# EAGLE design CxT6 (EAGLE 4.13)
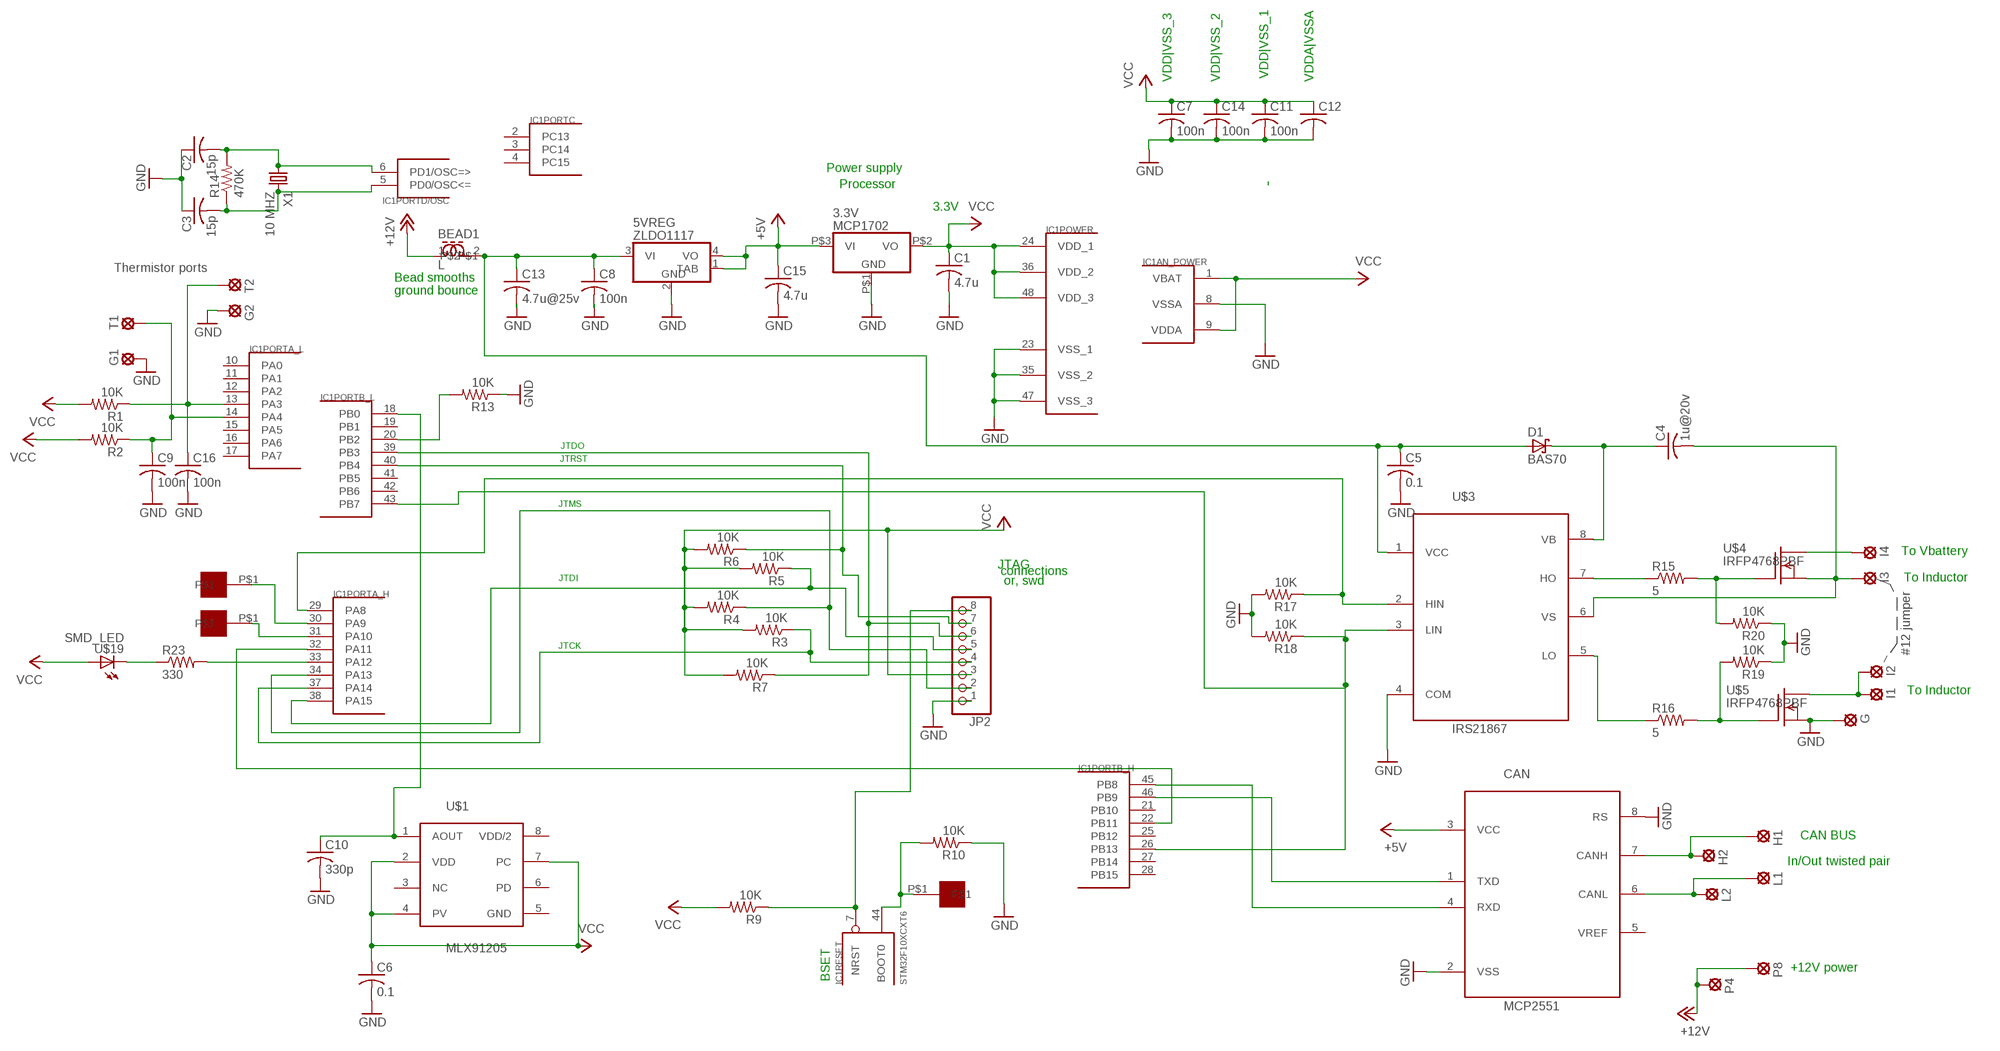
[diagram p0: schematic, sheet 1]

## Parts
3.3V  MCP1702  [SOT-23A]
5VREG  ZLDO1117  [SOT223]
B  SMD_1  [SMD_1]
BEAD1  L  L-BEAD  [C0805]
C1  4.7u  C-USC0805  [C0805]
C2  15p  C-USC0603  [C0603]
C3  15p  C-USC0603  [C0603]
C4  1u@20v  C-USC0603  [C0603]
C5  0.1  C-USC0603  [C0603]
C6  0.1  C-USC0603  [C0603]
C7  100n  C-USC0603  [C0603]
C8  100n  C-USC0603  [C0603]
C9  100n  C-USC0603  [C0603]
C10  330p  C-USC0603  [C0603]
C11  100n  C-USC0603  [C0603]
C12  C-USC0603  [C0603]
C13  4.7u@25v  C-USC0805  [C0805]
C14  100n  C-USC0603  [C0603]
C15  4.7u  C-USC0805  [C0805]
C16  100n  C-USC0603  [C0603]
CAN  MCP2551  [SO-08]
D1  BAS70  [SOT23]
G  SOLPAD081  [SOLPAD081]
G1  SOLDPAD028  [SOLPAD028]
G2  SOLDPAD028  [SOLPAD028]
H1  PE14  SOLDPAD028  [SOLPAD028]
H2  PE14  SOLDPAD028  [SOLPAD028]
I1  SOLPAD081  [SOLPAD081]
I2  SOLPAD081  [SOLPAD081]
I3  SOLPAD081  [SOLPAD081]
I4  SOLDPAD028  [SOLPAD028]
IC1  STM32F10XCXT6  [TQFP48]
JP2  PINHD-1X8  [1X08]
L1  PE14  SOLDPAD028  [SOLPAD028]
L2  PE14  SOLDPAD028  [SOLPAD028]
P4  PE14  SOLDPAD028  [SOLPAD028]
P8  PE14  SOLDPAD028  [SOLPAD028]
R  SMD_1  [SMD_1]
R1  10K  R-US_R0603  [R0603]
R2  10K  R-US_R0603  [R0603]
R3  10K  R-US_R0603  [R0603]
R4  10K  R-US_R0603  [R0603]
R5  10K  R-US_R0603  [R0603]
R6  10K  R-US_R0603  [R0603]
R7  10K  R-US_R0603  [R0603]
R9  10K  R-US_R0603  [R0603]
R10  10K  R-US_R0603  [R0603]
R13  10K  R-US_R0603  [R0603]
R14  470K  R-US_R0603  [R0603]
R15  5  R-US_R0603  [R0603]
R16  5  R-US_R0603  [R0603]
R17  10K  R-US_R0603  [R0603]
R18  10K  R-US_R0603  [R0603]
R19  10K  R-US_R0603  [R0603]
R20  10K  R-US_R0603  [R0603]
R23  330  R-US_R0603  [R0603]
T  SMD_1  [SMD_1]
T1  SOLDPAD028  [SOLPAD028]
T2  SOLDPAD028  [SOLPAD028]
U$1  MLX91205  [SO-08]
U$3  IRS21867  [SOIC8N]
U$4  IRFP4768PBF  [TO-247AC]
U$5  IRFP4768PBF  [TO-247AC]
U$19  SMD_LED  [SMD_LED]
X1  10 MHZ  CRYTALHC49UP  [HC49UP]

## Nets
+5V: 3.3V.P$3(VI) 5VREG.1(TAB) 5VREG.4(VO) C15.1 CAN.3(VCC)
+12_FILTERED: 5VREG.3(VI) BEAD1.2 C5.1 C8.1 C13.1 D1.1(A) U$3.1(VCC)
+12V: BEAD1.1 P4.MP P8.MP
BOOT0: B.P$1 IC1.44(RESET:BOOT0) R10.2
BOOT1: IC1.20(PORTB_L:PB2) R13.2
CANH: CAN.7(CANH) H1.MP H2.MP
CANL: CAN.6(CANL) L1.MP L2.MP
COM: C4.2 I3.MP U$3.6(VS) U$4.3(S)
GND: 3.3V.P$1(GND) 5VREG.2(GND) C1.2 C2.1 C3.1 C5.2 C6.2 C7.2 C8.2 C9.2 C10.2 C11.2 C12.2 C13.2 C14.2 C15.2 C16.2 CAN.2(VSS) CAN.8(RS) G1.MP G2.MP G.MP IC1.8(AN_POWER:VSSA) IC1.23(POWER:VSS_1) IC1.35(POWER:VSS_2) IC1.47(POWER:VSS_3) JP2.1 R10.1 R13.1 R17.2 R18.2 R19.1 R20.1 U$3.4(COM) U$5.3(S)
HO: R15.1 U$3.7(HO)
HO_GATE: R15.2 R20.2 U$4.1(G)
LED_K: R23.1 U$19.C
LO: R16.1 U$3.5(LO)
LO_GATE: R16.2 R19.2 U$5.1(G)
LOFET_DRAIN: I1.MP I2.MP U$5.2(D)
NRST: IC1.7(RESET:NRST) JP2.8 R9.1
OSC_IN: C3.2 IC1.5(PORTD/OSC:PD0/OSC<=) R14.1 X1.2
OSC_OUT: C2.2 IC1.6(PORTD/OSC:PD1/OSC=>) R14.2 X1.1
PA3_THERMISTOR1: C16.1 IC1.13(PORTA_L:PA3) R1.1 T2.MP
PA4_THERMISTOR2: C9.1 IC1.14(PORTA_L:PA4) R2.1 T1.MP
PA9_TX: IC1.30(PORTA_H:PA9) T.P$1
PA10_RX: IC1.31(PORTA_H:PA10) R.P$1
PA12_LED: IC1.33(PORTA_H:PA12) R23.2
PA13_JTIMS: IC1.34(PORTA_H:PA13) JP2.2 R4.1
PA14_JTCK: IC1.37(PORTA_H:PA14) JP2.4 R3.1
PA15_JTDI: IC1.38(PORTA_H:PA15) JP2.5 R5.1
PB1_ADC19_HALL: C10.1 IC1.18(PORTB_L:PB0) U$1.1(AOUT)
PB3_JTDO: IC1.39(PORTB_L:PB3) JP2.6 R7.1
PB4_JTRST: IC1.40(PORTB_L:PB4) JP2.7 R6.1
PB8_CANRX: CAN.4(RXD) IC1.45(PORTB_H:PB8)
PB9_CANTX: CAN.1(TXD) IC1.46(PORTB_H:PB9)
TIM1_1_HIN: IC1.29(PORTA_H:PA8) R17.1 U$3.2(HIN)
TIM1_1N_LIN: IC1.26(PORTB_H:PB13) IC1.43(PORTB_L:PB7) R18.1 U$3.3(LIN)
TIM14_TIM24: IC1.22(PORTB_H:PB11) IC1.32(PORTA_H:PA11)
VB: C4.1 D1.3(C) U$3.8(VB)
VBAT: I4.MP U$4.2(D)
VCC: 3.3V.P$2(VO) C1.1 C6.1 C7.1 C11.1 C12.1 C14.1 IC1.1(AN_POWER:VBAT) IC1.9(AN_POWER:VDDA) IC1.24(POWER:VDD_1) IC1.36(POWER:VDD_2) IC1.48(POWER:VDD_3) JP2.3 R1.2 R2.2 R3.2 R4.2 R5.2 R6.2 R7.2 R9.2 U$1.2(VDD) U$1.4(PV) U$1.7(PC) U$19.A
Unconnected: CAN.5(VREF) IC1.2(PORTC:PC13) IC1.3(PORTC:PC14) IC1.4(PORTC:PC15) IC1.10(PORTA_L:PA0) IC1.11(PORTA_L:PA1) IC1.12(PORTA_L:PA2) IC1.15(PORTA_L:PA5) IC1.16(PORTA_L:PA6) IC1.17(PORTA_L:PA7) IC1.19(PORTB_L:PB1) IC1.21(PORTB_H:PB10) IC1.25(PORTB_H:PB12) IC1.27(PORTB_H:PB14) IC1.28(PORTB_H:PB15) IC1.41(PORTB_L:PB5) IC1.42(PORTB_L:PB6) U$1.3(NC) U$1.6(PD) U$1.8(VDD/2)

## Notes on the sheet
- VDD|VSS_3 | VDD|VSS_2 | VDD|VSS_1 | VDDA|VSSA
- Power supply
- Processor
- 3.3V
- Thermistor ports
- Bead smooths
- ground bounce
- JTDO
- JTRST
- JTMS
- To Vbattery
- JTAG
- JTDI | connections
- or, swd | To Inductor
- JTCK
- #12 jumper
- To Inductor
- CAN BUS
- In/Out twisted pair
- +12V power
- BSET

## Power pins joined to a net without a drawn wire
GND: U$1.5(GND)

## Library data of the parts
3.3V = linear:MCP1702
5VREG = maxim:ZLDO1117
B R T = solpad:SMD_1
BEAD1 = rcl:L-BEAD
C1-C16 = rcl:C-US: CAPACITOR, American symbol
CAN = texas:MCP2551
D1 = diode-1:BAS70: Silicon Schottky Diodes General-purpose diode for high-speed switching
G I1-I3 = solpad:SOLPAD081
G1 G2 H1 H2 I4 L1 L2 P4 P8 T1 T2 = solpad:SOLDPAD028
IC1 = stm32:STM32F10XCXT6: ST STM32F101/103 48pin LQFP
JP2 = pinhead:PINHD-1X8: PIN HEADER
R1-R7 R9 R10 R13-R20 R23 = rcl:R-US_: RESISTOR, American symbol
U$1 = texas:MLX91205
U$3 = texas:IRS21867
U$4 U$5 = transistor-fet:IRFP4768PBF
U$19 = led:SMD_LED
X1 = crystal:CRYTAL: CRYSTAL

## Board
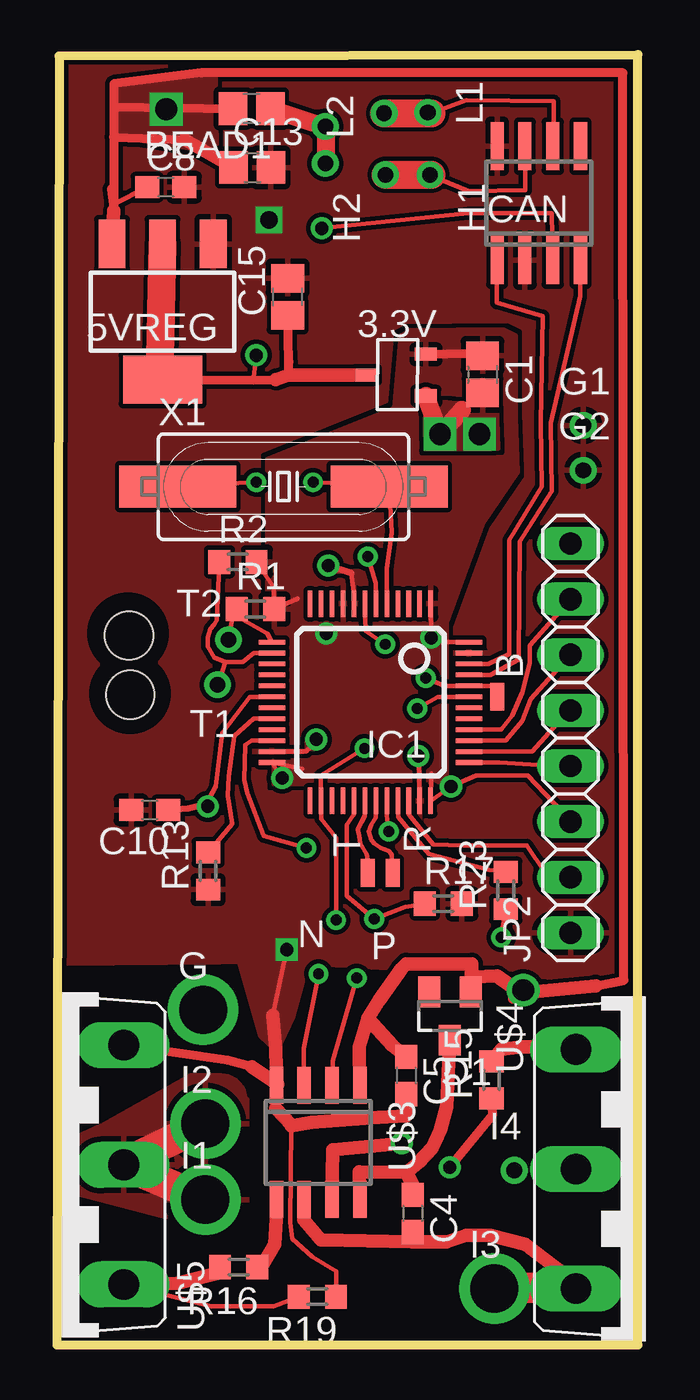
[diagram p1: board, top side]
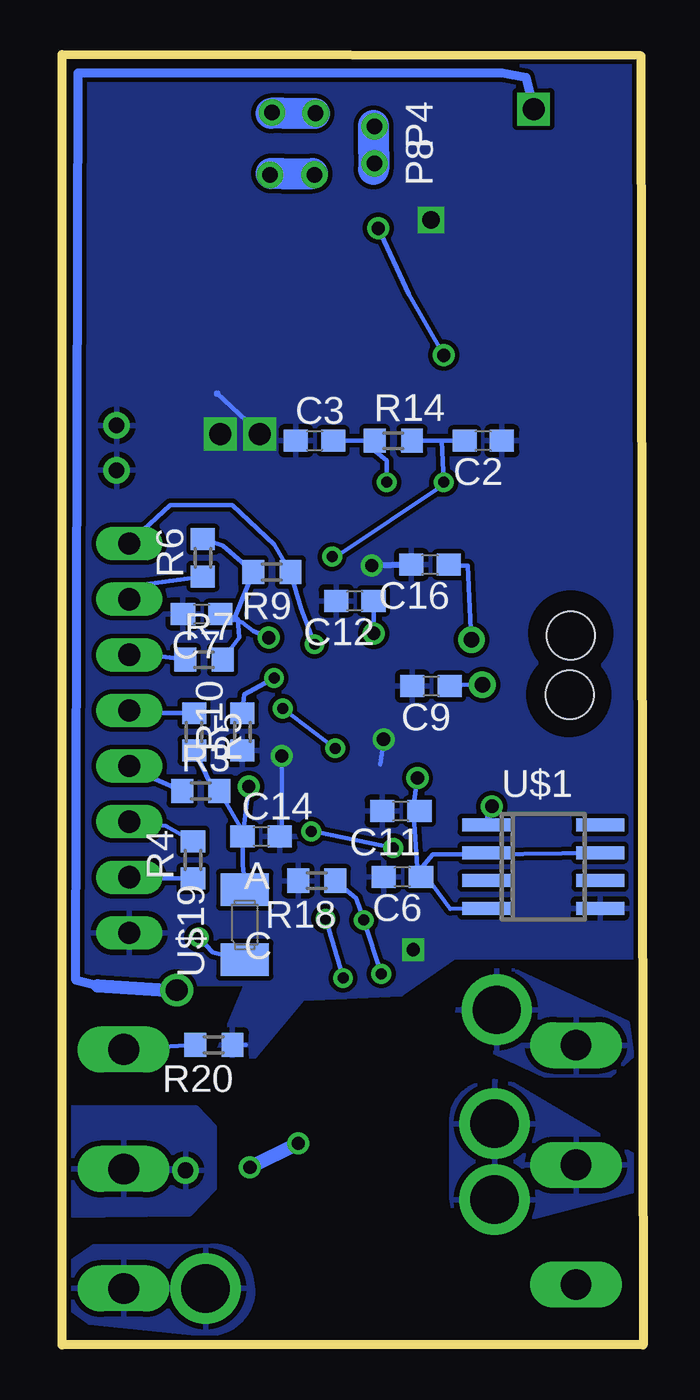
[diagram p2: board, bottom side, seen from below]

Size 26.53 x 58.93 mm. Coordinates in mm from the lower left corner, seen from the top.
Outline: 0.1,58.88 0,0 26.53,0 26.53,58.93 0.1,58.88
Copper layers (1*16): Top 0.035mm / dielectric 1.5mm / Bottom 0.035mm
Design rules "default": minimum track width 8mil, minimum drill 0.5mm, track to track 8mil, track to pad 8mil, pad to pad 8mil, via to via 8mil, smd to smd 0mil, copper to edge 8mil, drill to drill 8mil, minimum pad ring 10mil, minimum via ring 8mil, stop-mask expansion 4mil, vias tented up to drill 0mil, thermal gap 10mil
Holes 2.2 mm at 3.35,29.7 3.3,32.4
tRestrict: area 1.5,30.8 to 5,34.2; area 1.6,28 to 5.1,31.5
bRestrict: area 1.6,27.9 to 5.2,31.5; area 1.5,30.7 to 5.1,34.3

### Footprints (pad centres in the part's own frame; a part is rotated, then mirrored left to right if it is on the bottom)
SOT-23A = smd 0.6 x 1: P$1 -0.95,-1.35; P$2 0.95,-1.35; P$3 0,1.35
SOT223 = smd 3.6 x 2.2: 1 0,3.099 | smd 1.219 x 2.235: 2 -2.311,-3.099; 3 2.311,-3.099; 4 0,-3.099
SMD_1 = smd 1.27 x 0.635: P$1 0,0
C0805 = smd 1.3 x 1.5: 1 -0.85,0; 2 0.85,0
C0603 = smd 1.1 x 1: 1 -0.85,0; 2 0.85,0
SO-08 = smd 0.6 x 2.2: 1 -1.905,-2.6; 2 -0.635,-2.6; 3 0.635,-2.6; 4 1.905,-2.6; 5 1.905,2.6; 6 0.635,2.6; 7 -0.635,2.6; 8 -1.905,2.6
SOT23 = smd 1 x 1.4: 1 -0.95,-1.1; 2 0.95,-1.1; 3 0,1.1
SOLPAD081 = drill 2.2 pad 2.54 round: MP 0,0
SOLPAD028 = drill 0.711 pad 1.016 round: MP 0,0
TQFP48 = smd 0.208 x 1.2: 1 -2.75,-4.5; 2 -2.25,-4.5; 3 -1.75,-4.5; 4 -1.25,-4.5; 5 -0.75,-4.5; 6 -0.25,-4.5; 7 0.25,-4.5; 8 0.75,-4.5; 9 1.25,-4.5; 10 1.75,-4.5; 11 2.25,-4.5; 12 2.75,-4.5; 25 2.75,4.5; 26 2.25,4.5; 27 1.75,4.5; 28 1.25,4.5; 29 0.75,4.5; 30 0.25,4.5; 31 -0.25,4.5; 32 -0.75,4.5; 33 -1.25,4.5; 34 -1.75,4.5; 35 -2.25,4.5; 36 -2.75,4.5 | smd 1.2 x 0.208: 13 4.5,-2.75; 14 4.5,-2.25; 15 4.5,-1.75; 16 4.5,-1.25; 17 4.5,-0.75; 18 4.5,-0.25; 19 4.5,0.25; 20 4.5,0.75; 21 4.5,1.25; 22 4.5,1.75; 23 4.5,2.25; 24 4.5,2.75; 37 -4.5,2.75; 38 -4.5,2.25; 39 -4.5,1.75; 40 -4.5,1.25; 41 -4.5,0.75; 42 -4.5,0.25; 43 -4.5,-0.25; 44 -4.5,-0.75; 45 -4.5,-1.25; 46 -4.5,-1.75; 47 -4.5,-2.25; 48 -4.5,-2.75
1X08 = drill 1.016 long: 1 -8.89,0; 2 -6.35,0; 3 -3.81,0; 4 -1.27,0; 5 1.27,0; 6 3.81,0; 7 6.35,0; 8 8.89,0
R0603 = smd 1 x 1.1: 1 -0.85,0; 2 0.85,0
SOIC8N = smd 0.62 x 1.7: 1 -1.905,-2.8; 2 -0.635,-2.8; 3 0.635,-2.8; 4 1.905,-2.8; 5 1.905,2.4; 6 0.635,2.4; 7 -0.635,2.4; 8 -1.905,2.4
TO-247AC = drill 1.4 long: 1 -5.461,-0.635; 2 0,-0.635; 3 5.461,-0.635
SMD_LED = smd 2.2 x 1.5: A 0,1.6; C 0,-1.6
HC49UP = smd 5.334 x 1.93: 1 -4.826,0; 2 4.826,0

### Placement (x,y rotation side)
3.3V  15.5,44.3 90 top
5VREG  4.83,47.19 180 top
B  20.11,29.6 270 top
BEAD1  8.9,56.47 180 top
C1  19.44,44.33 270 top
C2  7.3,41.3 180 bottom
C3  15,41.3 0 bottom
C4  16.25,6 270 top
C5  15.95,12.3 270 top
C6  10.99,21.38 180 bottom
C7  20.16,33.38 180 bottom
C8  4.97,52.88 0 top
C9  9.68,30.09 180 bottom
C10  4.24,24.43 180 top
C11  11.06,24.38 180 bottom
C12  13.16,33.98 180 bottom
C13  8.92,53.78 0 top
C14  17.44,23.22 0 bottom
C15  10.54,47.87 90 top
C16  9.73,35.64 180 bottom
CAN  22.01,52.15 0 top
D1  17.95,15.02 180 top
G  6.68,15.3 0 top
G1  24.04,42 0 top
G2  24.04,39.95 0 top
H1  17.04,53.44 0 top
H2  15.01,53.45 0 top
I1  6.78,6.63 0 top
I2  6.78,10.1 0 top
I3  19.98,2.57 0 top
I4  20.89,7.97 0 top
IC1  14.32,29.35 180 top
JP2  23.46,27.71 90 top
L1  16.94,56.29 0 top
L2  14.95,56.26 90 top
P4  12.26,55.66 270 bottom
P8  12.26,53.96 270 bottom
R  15.34,21.55 90 top
R1  9.07,33.61 0 top
R2  8.27,35.76 0 top
R3  20.2,25.3 0 bottom
R4  20.55,22.15 90 bottom
R5  20.5,28 270 bottom
R6  20.1,35.95 90 bottom
R7  20.05,31.3 0 bottom
R9  16.95,35.3 180 bottom
R10  18.3,28 90 bottom
R13  6.91,21.64 90 top
R14  11.4,41.3 0 bottom
R15  19.85,12.1 90 top
R16  8.3,3.55 180 top
R17  17.65,20.15 0 top
R18  14.9,21.2 180 bottom
R19  11.9,2.2 180 top
R20  19.6,13.7 180 bottom
R23  20.5,20.75 90 top
T  14.2,21.55 90 top
T1  7.34,30.15 0 top
T2  7.84,32.2 0 top
U$1  4.56,21.84 270 bottom
U$3  11.93,9.05 180 top
U$4  24.35,8.03 270 top
U$5  2.42,8.22 90 top
U$19  18.19,19.19 0 bottom
X1  10.35,39.2 0 top

### Tracks (layer width: path | path; a pad name or v marks a point on that pad's centre or on a via)
+5V  (via drill 0.6)
  Top 0.203: 9,44.07 9,44.2 v9.1,45.2 | CAN.3 22.6,51.7 18.8,51.7 v12.1,51
  Top 0.406: 5VREG.1 9,44.07 10,44.1 | C15.1 10.6,44.9 10.6,44.3
  Top 0.61: 3.3V.P$3 10.6,44.3 10,44.1
  Top 1.27: 5VREG.1 4.7,44.1 5VREG.4
  Bottom 0.203: v12.1,51 10.7,48 v9.1,45.2
+12_FILTERED  (via drill 1)
  Top 0.203: 2.6,52.1 C8.1 | 2.6,56.55 2.59,55.17
  Top 0.406: 2.59,55.17 5.85,55.05 | 2.6,56.55 BEAD1.2 | 2.6,56.55 2.6,52.1 2.5,52.8 2.6,51.8 | 2.6,56.55 2.6,57.6 6.6,58.1 25.85,58.1 25.9,16.65 24.6,16.4 | 21.02,16.2 20.8,15.8 v21.3,16.2
  Top 0.61: 5.85,55.05 C13.1 | 2.6,51.8 5VREG.3 | U$3.1 13.8,13.6 14.2,14.92 | 14.2,14.92 14.7,15.7 15.75,17.2 15.95,17.4 18.95,17.4 D1.1 19.05,16.8 20.1,16.85 21.02,16.2 21.5,16.1 24.6,16.4 | 14.2,14.92 15.35,13.65 C5.1
  Bottom 0.406: v5,56.45 5.35,57.9 6.45,58.1 25.8,58.1 25.9,16.65 24.9,16.4
  Bottom 0.61: 21.05,16.15 24.9,16.4
  pour Top: 7.3,54.45 7.25,58.1 2.6,57.35 2.55,55.2
+12V
  Top 0.813: BEAD1.1 12.4,55.6 P4.MP 12.3,53.9 P8.MP
  Bottom 0.203: P8.MP 12.3,54.5
  Bottom 1.422: 12.3,55.7 12.3,54.5 12.3,53.7
BOOT0  (via drill 0.5)
  Top 0.203: v16.85,30.46 17.72,30.1 18.8,30.1 | B.P$1 20.15,30.1 18.8,30.1 | 18.8,30.1 IC1.44
  Bottom 0.203: R10.2 18.2,29.7 v16.85,30.46
BOOT1
  Top 0.203: R13.2 8,23.8 7.8,25.1 7.85,25.95 8.1,27.8 9,28.6 IC1.20
CANH
  Top 0.203: 17.1,53.24 H1.MP 18.8,52.7 21.4,52.75 21.4,54.8 CAN.7
  Top 0.406: 17.2,53.4 17.1,53.24 17.1,53.45
  Top 1.27: H2.MP 17.1,53.45
  Bottom 0.203: H1.MP 16.5,53.5
  Bottom 1.422: 15.1,53.5 16.5,53.5 17,53.5
CANL
  Top 0.203: 17.1,56.25 18.7,56.85 22.7,56.8 22.7,54.7 CAN.6
  Top 0.406: 17.1,56.25 L1.MP
  Top 1.27: L2.MP 17.1,56.25
  Bottom 0.203: L1.MP 16.4,56.25
  Bottom 1.422: 15,56.25 16.4,56.25 17,56.25
COM
  Top 0.61: U$3.6 11.28,5.7 12.05,4.8 16.2,4.7 C4.2 16.3,4.7 17.8,4.7 18.7,5 19.8,5 21.4,4.6 24,2.6 U$4.3
  Top 1.422: U$4.3 23.8,2.6 I3.MP
  pour Bottom: 26.4,3.6 25.1,4.5 19.9,4.5 arc90 17.9,3.1 17.8,2.5 arc90 19.8,0.5 20.4,0.5 25.3,1 26.4,1.8
GND  (via drill 0.6, 0.8, 1)
  Top 0.203: CAN.2 21.44,49.39 | IC1.35 16.58,24.73 16.56,26.02 v16.5,26.9 | 13.45,35.25 13.57,34.4 IC1.8 | 18.5,42.7 18.5,42.9 18.7,42.9 C1.2 | IC1.23 11.4,27.1 v11.85,27.66 | U$3.4 10.1,11.9 | R19.1 12.76,3.35 11.66,4.01 10.75,4.85 10.65,5.6 10.7,10 10.7,10.05 | U$3.4 10,11.75 10,10.8 | 9.85,15.05 v10.5,18.05 | U$3.4 10.05,11.7
  Top 0.305: v12.39,35.6 13.45,35.25
  Top 0.406: 5VREG.2 7.2,50.5 | U$5.3 7.8,13 8.9,12.7
  Top 0.61: 10.1,11.9 8.9,12.7 | 10.7,10.05 10,10.8 | 9.85,15.05 10,13.55 10.05,11.7 | C5.2 15.95,10.45 14.7,10.4 11.65,10.15 10.7,10
  Top 0.813: 3.3V.P$1 v17.5,41.6 18.5,42.7
  Bottom 0.203: v17.5,41.6 18.1,42.2 19.5,43.5 19.5,43.4 19.4,43.5 | C14.2 16.5,23.6 v16.5,26.9 | v11.85,27.66 12,26.5 | R20.1 18.2,13.7 18.14,13.7 | C16.2 10.6,35.65
  Bottom 0.305: 10.6,35.65 v12.39,35.6
  other vias: 19.3,41.6 9.69,51.39
  pour Bottom (rank 3): 0.2,58.95 27.1,59 26.45,16.5 18.11,16.46 19.5,13.2 17.75,13.15 15.55,15.8 11.05,16 8.6,17.7 0,17.7
  pour Top (rank 3): 0.1,58.95 27.15,58.95 26.4,16.55 9.9,17.5 0.2,17.4
  pour Top (rank 2): 11.6,17.9 10.8,15 10.05,13.4 9.3,14.1 8.2,17.95
  pour Bottom: 0.7,14.7 5.9,17.1 6.9,17.1 arc-61 8.1,16.4 arc-29 8.5,14.9 arc-49 8.1,14 arc-30 7.3,13.6 4.5,12.3 1.5,12.3 0.5,13.2
  pour Top: 18.7,42.95 20.1,42.95 20.15,40.95 16.85,40.9 16.8,43.2
HO  (via drill 0.6)
  Top 0.406: R15.1 19.9,10.5 v17.95,8.1
  Top 0.61: U$3.7 12.6,8.9 v15.75,9.2
  Bottom 0.61: v15.75,9.2 v17.95,8.1
HO_GATE
  Top 0.61: R15.2 20.3,13.5 21.2,13.6 24,13.6 U$4.1
  Bottom 0.203: U$4.1 23.9,13.5 R20.2
LED_K  (via drill 0.5)
  Top 0.203: v20.29,18.61 R23.1
  Bottom 0.203: v20.29,18.61 19.64,17.93 18.2,17.57 U$19.C
LO
  Top 0.61: U$3.5 10.01,5.72 9.95,4.6 9.2,3.3 R16.1
LO_GATE
  Top 0.203: U$5.1 7.05,1.75 9.9,1.75 R19.2
  Top 0.61: U$5.1 5.5,2.8 7.5,3.3 R16.2
LOFET_DRAIN
  Top 1.422: I1.MP 3.1,8.2 U$5.2 3.1,8.3 I2.MP
  pour Top: 2,10 6.1,12.3 7.5,12.3 arc-90 8.6,11.2 8.7,11.2 8.7,6.2 arc-79 7.8,5.1 0.9,6.9 0.9,9.5
  pour Bottom: 5.9,11.9 6.8,12.05 7.05,11.95 arc-90 8.75,10.3 8.75,6.7 arc-90 7.3,5.3 7,5.3 0.5,7 0.5,8.7
NRST  (via drill 0.5)
  Top 0.203: IC1.7 14.1,32.6 v15,32
  Bottom 0.203: v15,32 15.6,33.6 R9.1 16.85,36.55 18.75,38.35 21.6,38.35 23.45,36.65 JP2.8
OSC_IN  (via drill 0.5)
  Top 0.203: IC1.5 15.1,33.9 | v11.7,39.4 X1.2 15.3,37.1 15.07,35.46 IC1.5 | IC1.5 15.07,33.81
  Bottom 0.203: C3.2 R14.1 12.2,40.8 11.7,40.4 v11.7,39.4
OSC_OUT  (via drill 0.5)
  Top 0.203: X1.1 v9.1,39.4 | IC1.6 14.57,33.79 14.56,34.79 v14.2,36
  Bottom 0.203: 11,40.9 R14.2 9.2,41.3 | 9.2,41.3 C2.2 | 9.2,41.3 v9.1,39.4 9.1,39.3 14,36 v14.2,36
PA3_THERMISTOR1
  Top 0.203: IC1.13 9.6,32.5 8.2,33.3 R1.1 8,33.2 T2.MP
  Bottom 0.203: T2.MP 8,35.6 8.8,35.6 C16.1
PA4_THERMISTOR2
  Top 0.203: IC1.14 9,31.6 8.5,31.2 7.7,31.2 | 7.7,31.2 7.2,31.4 6.9,31.9 6.9,32.3 7,32.7 7.2,32.9 7.3,33.1 7.4,35.1 7.4,35.7 R2.1 | T1.MP 7.4,30.2 7.7,31.2
  Bottom 0.203: C9.1 7.4,30.2 T1.MP
PA9_TX
  Top 0.203: IC1.30 14.07,24.15 13.9,23.85 13.75,23.55 13.8,23.25 13.85,22.9 14.15,22.4 14.2,22.15 T.P$1
PA10_RX
  Top 0.203: IC1.31 14.57,24.89 14.56,24.08 14.35,23.75 14.25,23.45 14.35,23.05 14.5,22.9 14.8,22.7 15.15,22.55 15.3,22.4 15.35,21.65 R.P$1
PA12_LED
  Top 0.203: IC1.33 15.58,24.37 15.58,24.12 16.99,22.43 19.75,21.7 20.5,21.65 R23.2
PA13_JTIMS
  Top 0.203: IC1.34 16.07,24.22 17.2,22.85 18.55,22.8 21.45,22.8 22.3,21.55 23.5,21.35 JP2.2
  Bottom 0.203: JP2.2 23.45,21.3 R4.1
PA14_JTCK
  Top 0.203: IC1.37 20.2,26.6 23.45,26.4 JP2.4
  Bottom 0.203: JP2.4 23.55,26.4 R3.1
PA15_JTDI
  Top 0.203: IC1.38 21.7,27.1 23.4,29 JP2.5
  Bottom 0.203: R5.1 22.4,28.85 23.5,28.95 JP2.5
PB1_ADC19_HALL  (via drill 0.6)
  Top 0.203: 6.82,24.7 v6.9,24.6 | 6.82,24.7 7.25,25.5 7.55,27.95 8.8,29.6 IC1.18 10,29.6 | 6.8,24.7 6.82,24.7
  Top 0.305: C10.1 6,24.5 6.8,24.7
  Bottom 0.305: v6.9,24.6 U$1.1
PB3_JTDO
  Top 0.203: 18.8,27.6 IC1.39 20.5,27.6 21.25,28.5 21.65,29.5 23.45,31.5 JP2.6
  Bottom 0.203: JP2.6 23.55,31.65 R7.1
PB4_JTRST
  Top 0.203: IC1.40 20.3,28.1 20.8,28.75 21.25,29.8 21.6,31.15 21.6,31.95 23.5,34.1 JP2.7
  Bottom 0.203: R6.1 22.65,34.75 JP2.7
PB8_CANRX
  Top 0.203: CAN.4 23.9,47.9 22.55,42.1 22.6,39 21.15,36.7 21.1,31.3 19.8,30.6 IC1.45
PB9_CANTX
  Top 0.203: IC1.46 19.7,31.1 20.65,31.55 20.65,36.75 22.15,39.2 22.1,42.1 22.2,47 20.1,47.6 20.1,49.5 CAN.1
TIM1_1_HIN  (via drill 0.5)
  Top 0.203: R17.1 15.9,20 v14.5,19.45 13.25,20.5 13.25,23.75 13.57,24.23 IC1.29 13.57,24.89 | U$3.2 12.6,11.9 12.6,12.97 v13.7,16.75
  Bottom 0.203: v13.7,16.75 v14.5,19.45
TIM1_1N_LIN  (via drill 0.5)
  Top 0.203: v12.75,19.4 12.75,23.15 12.07,24.02 IC1.26 12.08,24.87 12.06,26.01 v14.05,27.25 | U$3.3 11.28,11.91 11.28,13.53 v11.95,16.95 | IC1.43 17.4,29.59 v16.46,29.07
  Bottom 0.203: R18.1 13.1,20.4 v12.75,19.4 v11.95,16.95 | v14.05,27.25 v16.46,29.07
TIM14_TIM24  (via drill 0.5)
  Top 0.203: v15.15,23.45 15.07,24.19 IC1.32 | v11.4,22.7 9.45,23.25 8.7,25.2 8.55,25.8 8.6,27.4 8.9,27.6 IC1.22 9.9,27.6
  Bottom 0.203: v15.15,23.45 14.8,23.4 v11.4,22.7
VB
  Top 0.61: U$3.8 13.8,7.9 15.99,7.89 | 15.99,7.89 16.5,8.3 17.15,9 17.5,9.8 17.8,10.9 D1.3 | C4.1 16.3,7.2 16,7.8 15.99,7.89
VBAT
  pour Bottom: 26.45,10.85 20.4,10.85 19.55,9.95 19.55,7.15 20.7,5.95 26.5,5.9
VCC  (via drill 0.6)
  Top 0.203: IC1.1 v17.1,32.3 17.5,32.1 IC1.48 | 11.2,26.3 IC1.24 v10.3,25.9 | 17.1,26.1 IC1.36 v18,25.5 19.15,26 21.5,26 23.45,23.95 JP2.3 | 11,34.1 R1.2 9.9,33.6 9.9,34.6 R2.2
  Top 0.406: C1.1 18.8,45.3 3.3V.P$2
  Bottom 0.203: v17.1,32.3 17.8,32.6 18.3,33 C7.1 | C14.1 v18,25.5 | 10.5,24.5 C11.1 | 10.5,24.5 v10.3,25.9 | 7.2,22.4 U$1.2 | U$1.7 7.2,22.4 | U$1.4 8.8,19.9 10.2,21.8 C6.1 | 7.2,22.4 9.6,22.4 10.2,21.7 C6.1 | C6.1 10.3,21.8 10.5,24.5 | C7.1 18.7,33.1 R9.2 19.2,36.5 20.05,36.8 R6.2 | v12.3,32.5 12.3,33.5 C12.1 | R5.2 19.4,24.9 R3.2 18.4,23.65 C14.1 | R4.2 21.8,23.7 23.5,23.9 JP2.3 | R7.2 18.45,32.3 18.5,33.15 C7.1 | C14.1 18.4,23.6 | C14.1 18.27,21.91 18.16,20.9 U$19.A
  pour Top (rank 2): 16.15,46.35 20.35,46.4 20.95,46.1 20.95,42.4 21.05,39.85 19.45,37.5 17.8,33 17.8,25.7 9.9,25.6 9.9,33 9.6,33.15 9.6,40.45 15.4,42.8 15.7,46.1

### Text on the board
tNames: N | P
tDocu: S | D | D | LO | HI | S